# Altium project Controle.PrjPcb
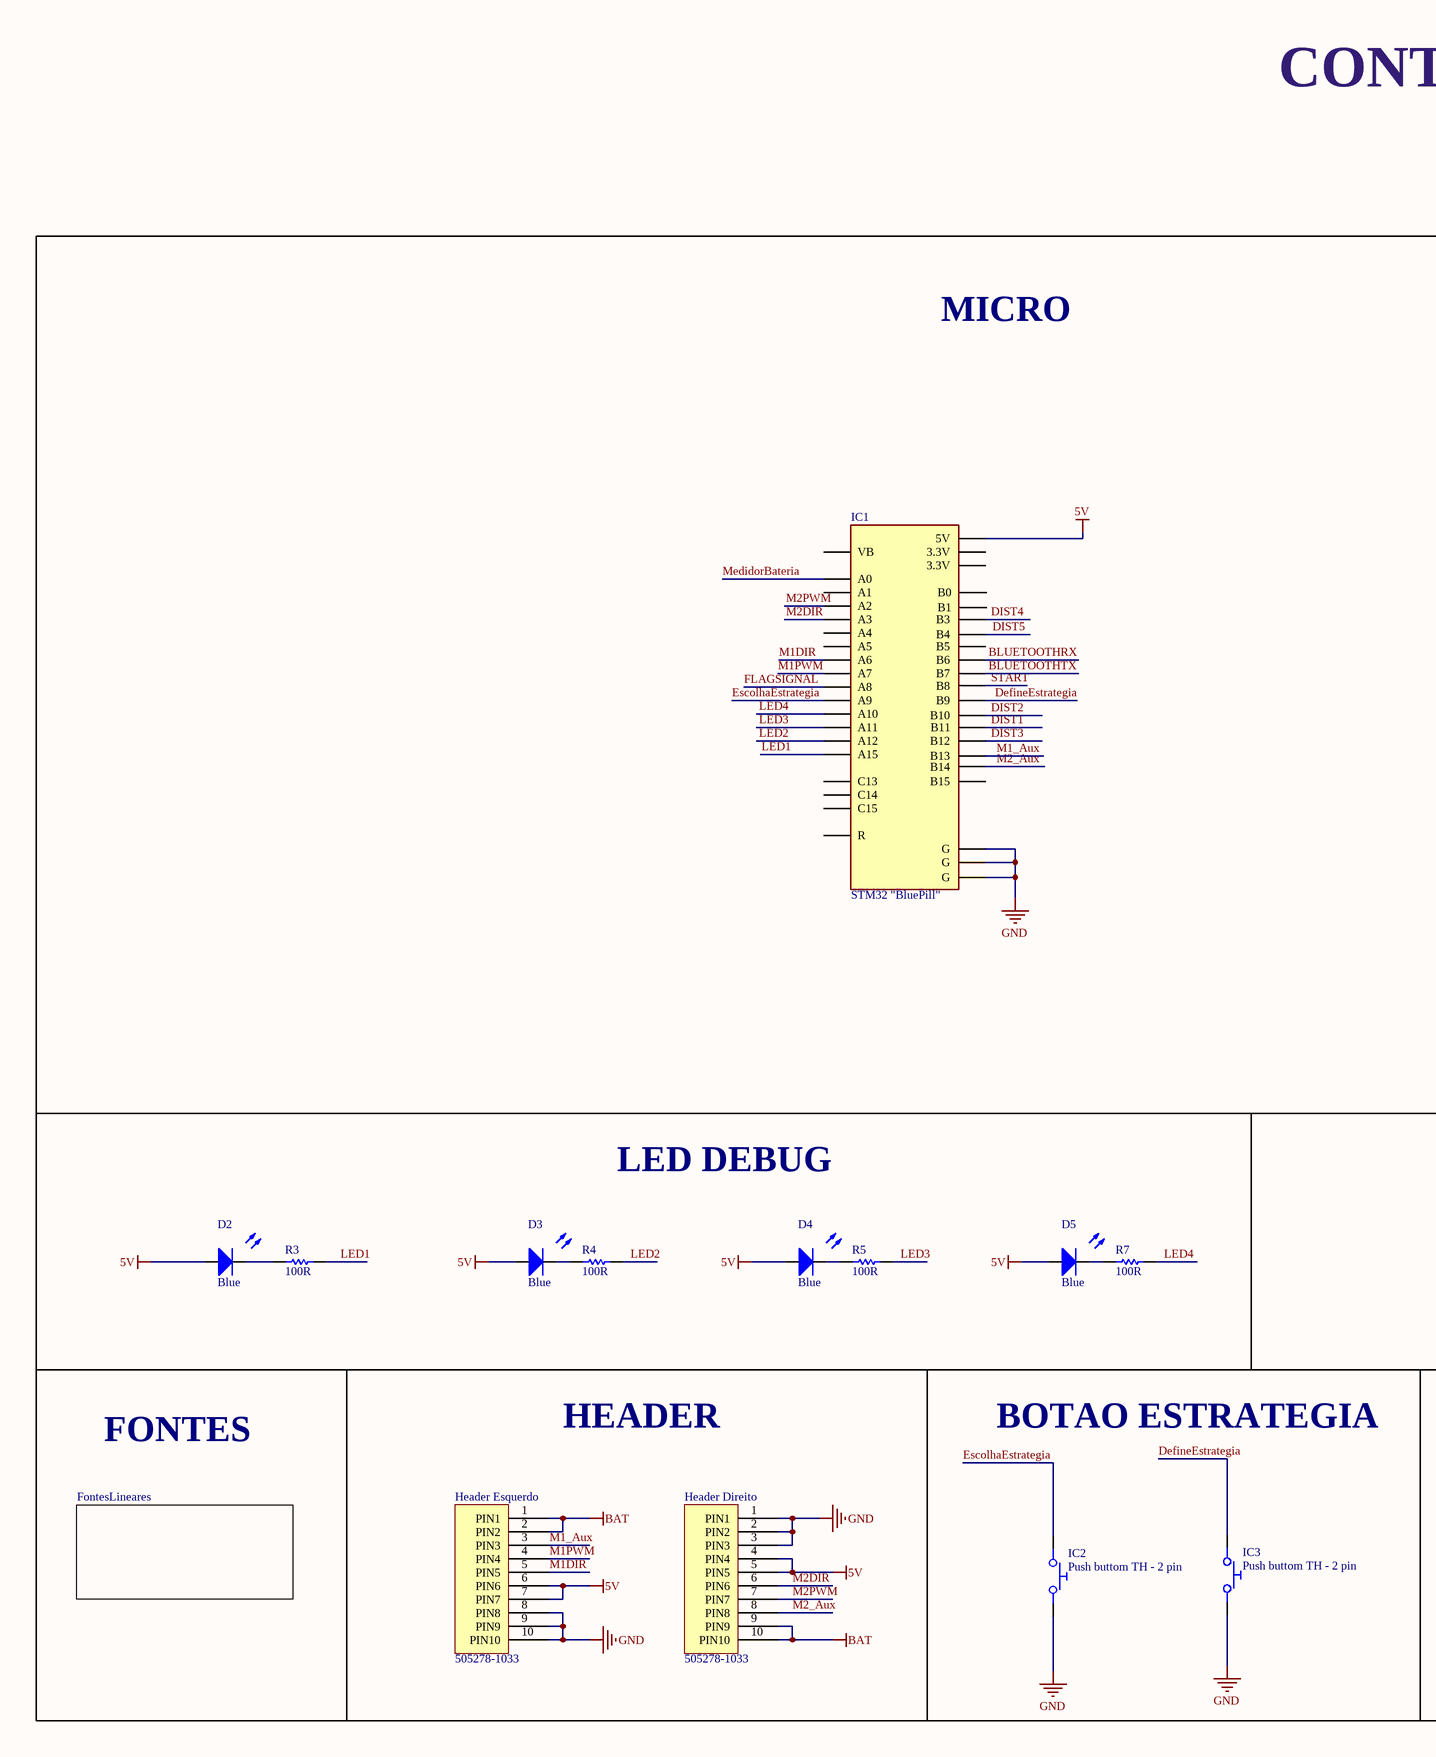
[diagram p0: controleBluePill.SchDoc, left]
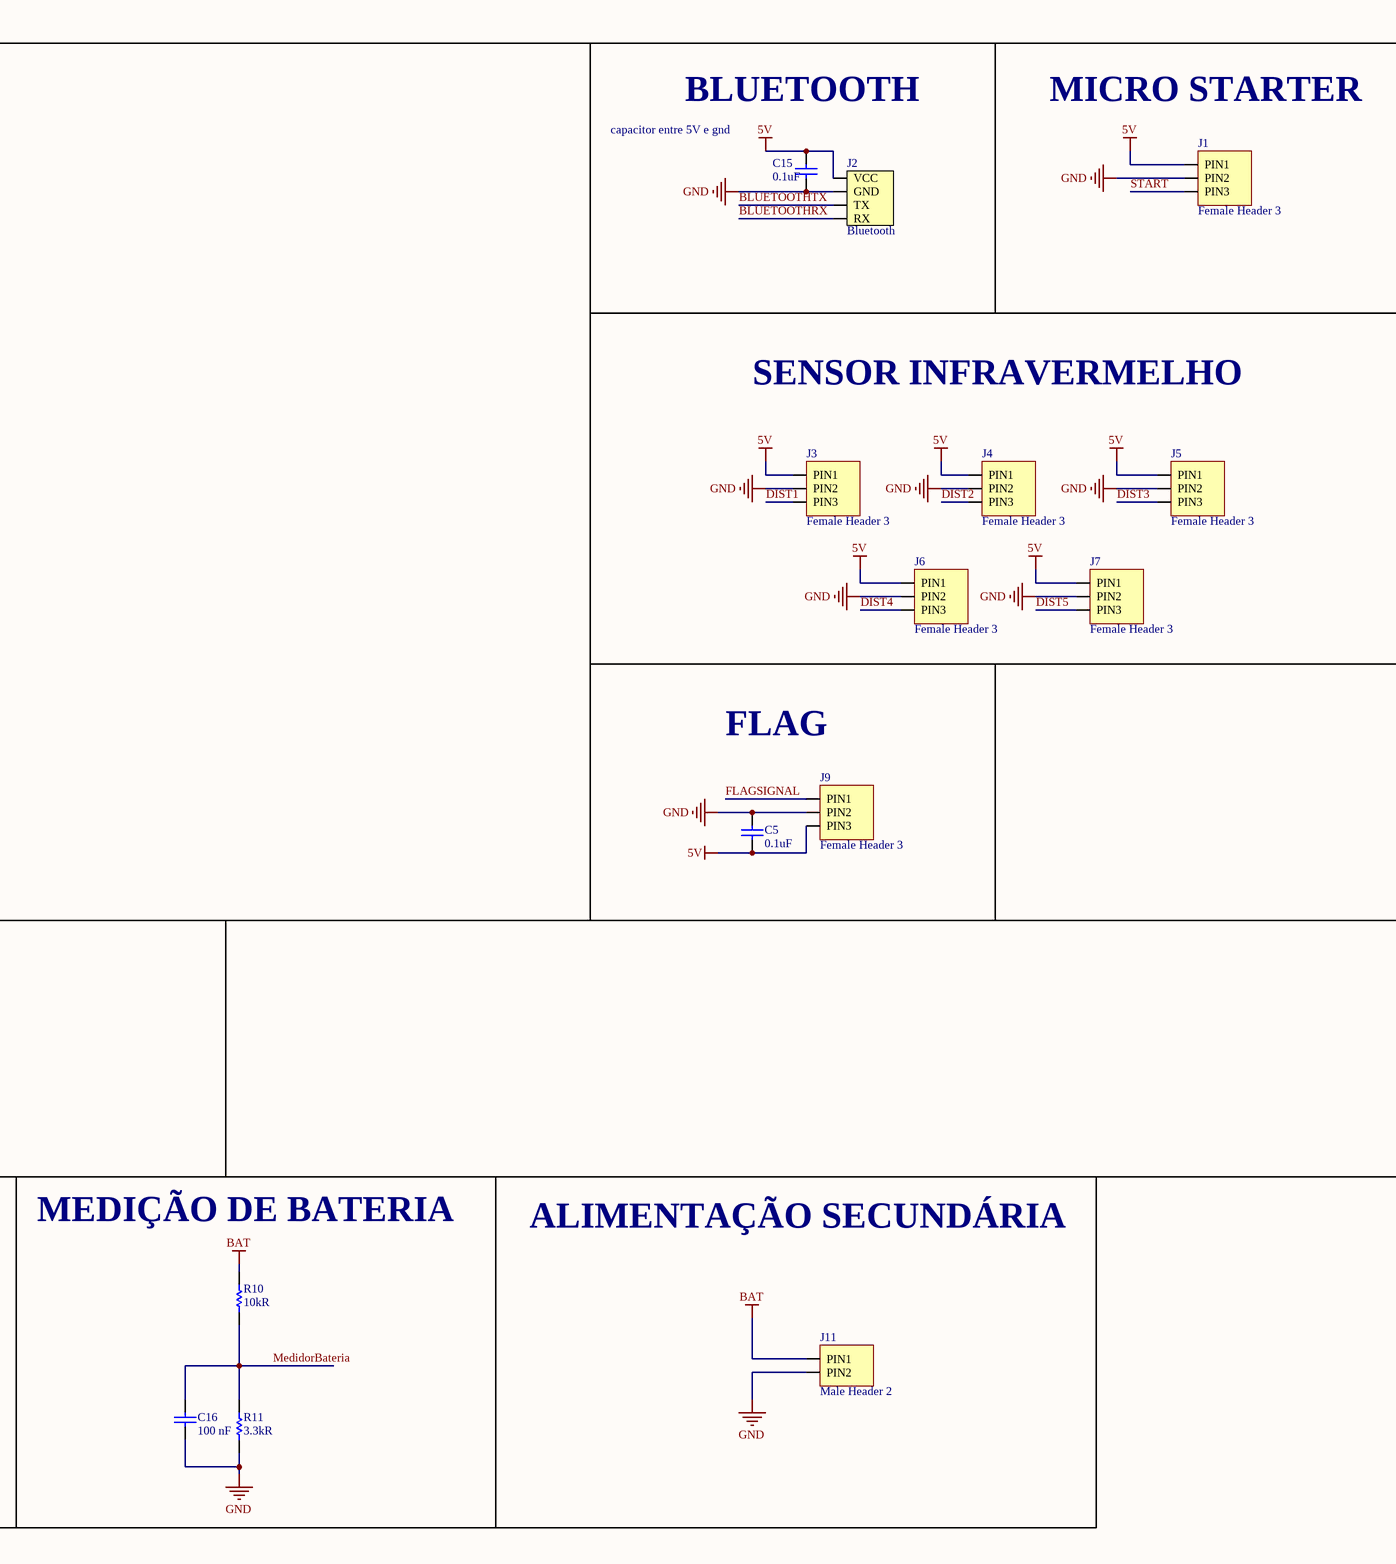
[diagram p1: controleBluePill.SchDoc, right]
1 sheet, 27 parts. Net scope: global (net labels, ports and power ports of the same name join across sheets).
Board file: ControleBluePill.PcbDoc

## Sheet controleBluePill.SchDoc
size A2; SheetNumber: 1; SheetTotal: 2

### Parts
C5  0.1uF  [C0805]
C15  0.1uF  [C0805]
C16  100 nF  [C0805]
D2  Blue  [DIODO_2-SMD-3215]
D3  Blue  [DIODO_2-SMD-3215]
D4  Blue  [DIODO_2-SMD-3215]
D5  Blue  [DIODO_2-SMD-3215]
Header_Direito  505278-1033  [FPC_CON]
Header_Esquerdo  505278-1033  [FPC_CON]
IC1  STM32 "BluePill"  [BluePill]
IC2  Push buttom TH - 2 pin  [BUTTON - TH - 2PIN]
IC3  Push buttom TH - 2 pin  [BUTTON - TH - 2PIN]
J1  Female Header 3  [FEMALE HEADER 3]
J2  Bluetooth  [BLUETOOTH]
J3  Female Header 3  [FEMALE HEADER 3]
J4  Female Header 3  [FEMALE HEADER 3]
J5  Female Header 3  [FEMALE HEADER 3]
J6  Female Header 3  [FEMALE HEADER 3]
J7  Female Header 3  [FEMALE HEADER 3]
J9  Female Header 3  [FEMALE HEADER 3]
J11  Male Header 2  [MALE HEADER 2]
R3  100R  [RESISTOR_0805]
R4  100R  [RESISTOR_0805]
R5  100R  [RESISTOR_0805]
R7  100R  [RESISTOR_0805]
R10  10kR  [RESISTOR_0603]
R11  3.3kR  [RESISTOR_0603]

### Sub-sheets
FontesLineares = FontesLineares (file not in this document): no entries

### Nets
5V: C5.1 C15.2 D2.A D3.A D4.A D5.A Header_Direito.4(PIN4) Header_Direito.5(PIN5) Header_Esquerdo.6(PIN6) Header_Esquerdo.7(PIN7) IC1.5V J1.PIN1 J2.VCC J3.PIN1 J4.PIN1 J5.PIN1 J6.PIN1 J7.PIN1 J9.PIN3
BAT: Header_Direito.9(PIN9) Header_Direito.10(PIN10) Header_Esquerdo.1(PIN1) Header_Esquerdo.2(PIN2) J11.PIN1 R10.2
GND: C5.2 C15.1 C16.1 Header_Direito.1(PIN1) Header_Direito.2(PIN2) Header_Direito.3(PIN3) Header_Esquerdo.8(PIN8) Header_Esquerdo.9(PIN9) Header_Esquerdo.10(PIN10) IC1.G IC2.2 IC3.2 J1.PIN2 J2.GND J3.PIN2 J4.PIN2 J5.PIN2 J6.PIN2 J7.PIN2 J9.PIN2 J11.PIN2 R11.1
BLUETOOTHRX: IC1.B6 J2.RX
BLUETOOTHTX: IC1.B7 J2.TX
DefineEstrategia: IC1.B9 IC3.1
DIST1: IC1.B11 J3.PIN3
DIST2: IC1.B10 J4.PIN3
DIST3: IC1.B12 J5.PIN3
DIST4: IC1.B3 J6.PIN3
DIST5: IC1.B4 J7.PIN3
EscolhaEstrategia: IC1.A9 IC2.1
FLAGSIGNAL: IC1.A8 J9.PIN1
LED1: IC1.A15 R3.2
LED2: IC1.A12 R4.2
LED3: IC1.A11 R5.2
LED4: IC1.A10 R7.2
M1_Aux: Header_Esquerdo.3(PIN3) IC1.B13
M1DIR: Header_Esquerdo.5(PIN5) IC1.A6
M1PWM: Header_Esquerdo.4(PIN4) IC1.A7
M2_Aux: Header_Direito.8(PIN8) IC1.B14
M2DIR: Header_Direito.6(PIN6) IC1.A3
M2PWM: Header_Direito.7(PIN7) IC1.A2
MedidorBateria: C16.2 IC1.A0 R10.1 R11.2
START: IC1.B8 J1.PIN3
NetD2_C: D2.C R3.1
NetD3_C: D3.C R4.1
NetD4_C: D4.C R5.1
NetD5_C: D5.C R7.1

Not connected (* = marked no-connect by the designer): IC1 3.3V A1 A4 A5 B0 B1 B5 B15 C13 C14 C15 R VB

### Notes on the sheet
- CONTROLE
- MICRO
- capacitor entre 5V e gnd
- BLUETOOTH
- MICRO STARTER
- SENSOR INFRAVERMELHO
- FLAG
- LED DEBUG
- FONTES
- HEADER
- BOTAO ESTRATEGIA
- MEDIÇÃO DE BATERIA
- ALIMENTAÇÃO SECUNDÁRIA

### Library data of the parts
C5 C15 = C0805C104M3RACTU: CAP CER 0.1uF 25V X7R 0805; Manufacturer: Kemet; Tolerance: 20%; Voltage - Rated: 25 VDC; Library Control - Checked Footprint: No; Library Control - Checked Schematic: Yes; Library Control - Person that Checked Schematic: Guilherme; Library Control - Person that did the Last Update Schematic: Marcos; Supplier 1: Mouser; Part Number: C0805C104M3RACTU; Category: Ceramic Capacitor; Price: 1=0,13 10=0,064 100=0,037 1000=0,025 (USD); Supplier Part Number 1: 80-C0805C104M3R; Library Ref: Capacitor; Operating Temperature: -55 C ~ 125 C; Package / Case: 0805(2012 mestric); Size / Dimension: 1.25 mm W x 2 mm L x 0.78 mm H; Value: 0.1uF; ESR: -; Dieletric: X7R; Library Control - Last Update: 26/06/2021 20:52; ComponentLink1Description: Datasheet; ComponentLink1URL: https://br.mouser.com/datasheet/2/212/KEM_C1002_X7R_SMD-1102033.pdf; ComponentLink2Description: Mouser Link; ComponentLink2URL: https://br.mouser.com/ProductDetail/KEMET/C0805C104M3RACTU?qs=jbCUrP3sAgSIdMuvv9W4Pg%3D%3D
C16 = 885012207128: CAP CER 100 nF 100V X7R 0805; Manufacturer: Wurth Elektronik; Tolerance: 10%; Voltage - Rated: 100 VDC; Library Control - Checked Footprint: Yes; Supplier 1: Mouser; Part Number: 885012207128; Category: Ceramic capacitor; Price: 1=0,41 10=0,283 100=0,169 1000=0,107 (USD); Supplier Part Number 1: 710-885012207128; Library Ref: Capacitor; Operating Temperature: -55°C ~125ºC; Package / Case: 0805(2012 Metric); Size / Dimension: 2 mm L  x 1.25 mm W x 1.25 mm H; Value: 100 nF; ESR: -; Dieletric: X7R; Library Control - Checked Schematic: Yes; ComponentLink1Description: Datasheet; ComponentLink1URL: https://br.mouser.com/datasheet/2/445/885012207128-1727772.pdf; ComponentLink2Description: Mouser Link; ComponentLink2URL: https://br.mouser.com/ProductDetail/Wurth-Elektronik/885012207128?qs=MLItCLRbWsys1TnbPEYt%252BQ%3D%3D
D2-D5 = EAST3215BA5: LED 75mW BLUE 45MCD 3215; Manufacturer: Everlight Electronics; Current - Forward (If): 20 mA; Voltage - Forward (Vf): 3,30 V; Viewing Angle: 130°; Wavelength: 468 nm; Reverse Voltage: 5 V; Library Control - Checked Footprint: yes; Library Control - Person that Checked Footprint: Lucas; Library Control - Person that did the Last Update Footprint: Stéfany (Ster); Supplier 1: Mouser; Part Number: EAST3215BA5; Category: Standard LEDs - SMD; Price: 1 = 0,3800, 10 = 0,2050, 100 = 0.1080 (USD); Package / Case: 3215; Color: Blue; Operating Temperature: - 40 °C ~ 85 °C; Luminous Intensity: 45 mcd; Library Ref: Diodo/Led; Supplier Part Number 1: 638-EAST3215BA5; Max Power Dissipation: 75 mW; Max Current Rating: 20 mA; Library Control - Checked Schematic: yes; Library Control - Last Update: 13/06/2021 12:45; Library Control - Person that Checked Schematic: Lucas; Library Control - Person that did the Last Update Schematic: Stéfany (Ster); ComponentLink1Description: Mouser Link; ComponentLink1URL: https://www.mouser.com/ProductDetail/Everlight/EAST3215BA5?qs=Cqqh%252BS766wnzp9nQVj5A4g==; ComponentLink2Description: Datasheet; ComponentLink2URL: https://www.mouser.com/datasheet/2/143/EAST3215BA5-1154292.pdf
Header_Direito Header_Esquerdo = 505278-1033_BODY: CONN FFC/FPC HORZ 10POS 0.50MM; Manufacturer: Molex; Current Rating (Amps): 500mA; Number of Positions: 10; Library Control - Checked Footprint: Yes; Library Control - Last Project that Used: Follow-Final; Library Control - Person that Checked Footprint: Lucas; Library Control - Person that did the Last Update Footprint: Mateus(Dimas); Supplier 1: Mouser; Part Number: 505278-1033; Category: Connectors; Price: 1=0,51000, 10=0,42900, 100=0,33400 (USD); Mounting Type: Right Angle; Contact Material: Tin; Operating Temperature: -40°C ~ 85°C; Library Ref: Connectors; Number of Rows: 1; Termination: SMD; Insulation Material: Liquid Crystal Polymer; Contact Type: FFC/FPC; Pitch: 0.50mm; Contact Length - Mating: 0.50mm; Supplier Part Number 1: 538-505278-1033; Library Control - Checked Schematic: Yes; Library Control - Last Update: 24/04/2021 00:25; Library Control - Person that Checked Schematic: Lucas; Library Control - Person that did the Last Update Schematic: Mateus(Dimas); ComponentLink1Description: Datasheet; ComponentLink1URL: https://br.mouser.com/datasheet/2/276/2/5052781033_FFC_FPC_CONNECTORS-772019.pdf; ComponentLink2Description: Mouser Link; ComponentLink2URL: https://br.mouser.com/ProductDetail/Molex/505278-1033?qs=c8NFF48pVsDStgrQCBOSTg%3D%3D
IC2 IC3 = Push buttom TH - 2 pin: Push buttom true hole with 2 pin; Manufacturer_Name: CUI Inc.; Manufacturer_Part_Number: TS02-66-90-BK-100-SCR-D; Height: 9.2mm; ComponentLink1Description: Datasheet; ComponentLink1URL: https://www.gravitech.us/mipubusw2qt4.html
J1 J3-J7 J9 = Female Header 3: Number of Contacts: 3; System: Connector; Library Ref: Header
J2 = Barramento Bluetooth: BARRAMENTO BLUETOOTH HC-06; Number of Contacts: 4; Bluetooth Mode: Slave Only; Operating Voltage: 3,6 / 6 (V); Max Range: 10m; Frequency: 2,4 GHz; Modulation: GFSK (Gaussian Frequency Shift Keying); Recomended Operating Configuration: 5V @ 50mA; Maximum Serial Transmission Rate: 9600 bps; Library Ref: Header
J11 = Male Header 2: Number of Contacts: 2; Library Control - Person that did the Last Update Schematic: Marcos; System: Connector; Library Ref: Header; Library Control - Checked Footprint: *; Library Control - Checked Schematic: *; Library Control - Last Project that Used: *; Library Control - Last Update: *; Library Control - Person that Checked Footprint: *; Library Control - Person that Checked Schematic: *; Library Control - Persont that did the Last Update Footprint: Marcos
R3-R5 R7 = CRCW0805100RFKEA: RES SMD 100 OHM 1% 1/8W 0805; Manufacturer: Vishay / Dale; Temperature Coefficient: 100 PPM / C; Power Rating: 125 mW (1/8 W); Voltage Rating: 150 V; Library Control - Checked Footprint: No; Library Control - Checked Schematic: Yes; Library Control - Person that Checked Schematic: Marcos; Library Control - Person that did the Last Update Footprint: Dalarme; Supplier 1: Mouser; Part Number: CRCW0805100RFKEA; Category: Thick Film Resistors - SMD; Price: 1=0,18, 10=0,065, 100=0,027, 1000=0,012 (USD); Package / Case: 0805 (2012 Metric); Operating Temperature: - 55ºC ~ 155ºC; Value: 100R; Tolerance: 1 %; Library Ref: Resistor; Resistor Type: Fixo; Size / Dimension: 2 mm L x  1.25 mm W x  0.45 mm H; Supplier Part Number 1: 71-CRCW0805-100-E3; Library Control - Last Update: 20/06/21 16:56; Library Control - Person that did the Last Update Schematic: Marcos; ComponentLink1Description: Mouser Link; ComponentLink1URL: https://www.mouser.com/ProductDetail/Vishay-Dale/CRCW0805100RFKEA?qs=sGAEpiMZZMu61qfTUdNhG2DpbjADlD3GxPcNG3UnvYk%3D; ComponentLink2Description: Datasheet Link; ComponentLink2URL: https://www.mouser.com/datasheet/2/427/dcrcwe3-1762152.pdf
R10 = RC0603JR-0710KL: RES SMD 10K OHM 5% 1/10W 0603; Manufacturer: Yageo; Temperature Coefficient: 100 PPM / C; Power Rating: 100 mW (1/10 W); Voltage Rating: 75 V; Library Control - Checked Footprint: No; Library Control - Checked Schematic: Yes; Library Control - Person that Checked Schematic: Marcos; Library Control - Person that did the Last Update Footprint: Dalarme; Supplier 1: Mouser; Part Number: RC0603JR-0710KL; Category: Thick Film Resistors - SMD; Price: 1=0,10, 10=0,015, 100=0,005 1000=0,0040 (USD); Package / Case: 0603 (1608 Metric); Operating Temperature: - 55ºC ~ 155ºC; Value: 10kR; Tolerance: 5 %; Library Ref: Resistor; Resistor Type: Fixo; Size / Dimension: 1.6 mm L x  0.8 mm W x  0.45 mm H; Supplier Part Number 1: 603-RC0603JR-0710KL; Library Control - Last Update: 21/06/21 14:15; Library Control - Person that did the Last Update Schematic: Marcos; ComponentLink1Description: Mouser Link; ComponentLink1URL: https://br.mouser.com/ProductDetail/Yageo/RC0603JR-0710KL?qs=ksOUTF%2FWcd8D6T22BJkQ7g%3D%3D; ComponentLink2Description: Datsheet Link; ComponentLink2URL: https://br.mouser.com/datasheet/2/447/Yageo_03_18_2021_PYu_RC_Group_51_RoHS_L_11-2199992.pdf
R11 = CRGCQ0603F3K3: RES SMD 3.3K OHM 1% 1/10W 0603; Manufacturer: TE Connectivity / Holsworthy; Temperature Coefficient: 100 PPM / C; Power Rating: 100 mW (1/10 W); Voltage Rating: 75 V; Library Control - Checked Footprint: Yes; Library Control - Person that Checked Footprint: Nikaum; Library Control - Person that Checked Schematic: Guilherme; Library Control - Person that did the Last Update Footprint: Dalarme; Supplier 1: Mouser; Part Number: CRGCQ0603F3K3; Category: Thick Film Resistors; Price: 1=0,10, 10=0,029, 100=0,011 (USD); Package / Case: 0603 (1608 Metric); Operating Temperature: - 55ºC ~ 125ºC; Value: 3.3kR; Tolerance: 1 %; Library Ref: Resistor; Resistor Type: Fixed; Size / Dimension: 1.6 mm L x  0.8 mm W x  0.45 mm H; Supplier Part Number 1: 279-CRGCQ0603F3K3; Library Control - Checked Schematic: Yes; Library Control - Last Update: 27/06/2021 20:27; Library Control - Person that did the Last Update Schematic: Dalarme; ComponentLink1Description: Mouser Link; ComponentLink1URL: https://br.mouser.com/ProductDetail/TE-Connectivity-Holsworthy/CRGCQ0603F3K3?qs=sGAEpiMZZMvdGkrng054t7z4BkURc4Lz7mzhBruKq8fwVJ16OlxZFQ%3D%3D; ComponentLink2Description: Datasheet; ComponentLink2URL: https://br.mouser.com/datasheet/2/418/4/NG_DS_1773204-3_1-1358553.pdf